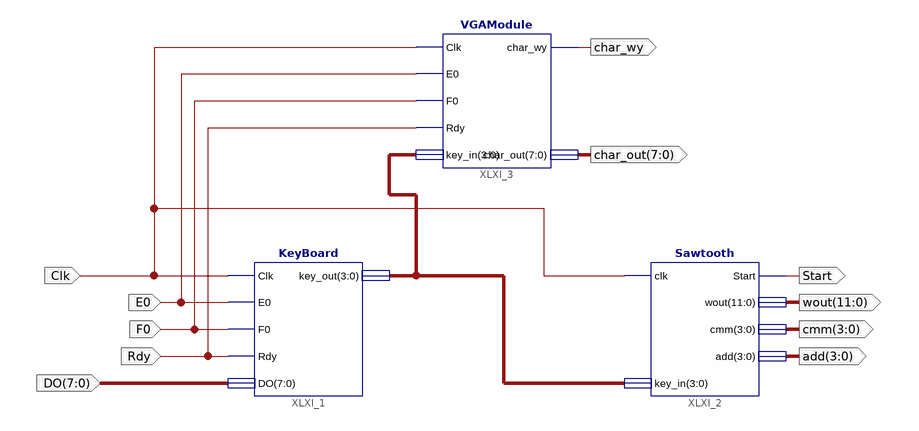
[diagram p0: schematic sheet 1]
// Xilinx ISE schematic VGAAndSoundAndKeyboardSchema.sch (spartan3e) as structural Verilog: 3 symbols, 11 ports
module VGAAndSoundAndKeyboardSchema (
  input  Clk,
  input  E0,
  input  F0,
  input  Rdy,
  input  [7:0] DO,
  output char_wy,
  output [7:0] char_out,
  output Start,
  output [11:0] wout,
  output [3:0] cmm,
  output [3:0] add
);

  wire [3:0] XLXN_1;

  KeyBoard XLXI_1 (.Clk(Clk), .E0(E0), .F0(F0), .Rdy(Rdy), .DO(DO), .key_out(XLXN_1));
  Sawtooth XLXI_2 (.clk(Clk), .Start(Start), .wout(wout), .cmm(cmm), .add(add), .key_in(XLXN_1));
  VGAModule XLXI_3 (.Clk(Clk), .E0(E0), .F0(F0), .Rdy(Rdy), .key_in(XLXN_1), .char_wy(char_wy), .char_out(char_out));
endmodule
